# Altium schematic sheet PowerSupplies.SchDoc
size A4
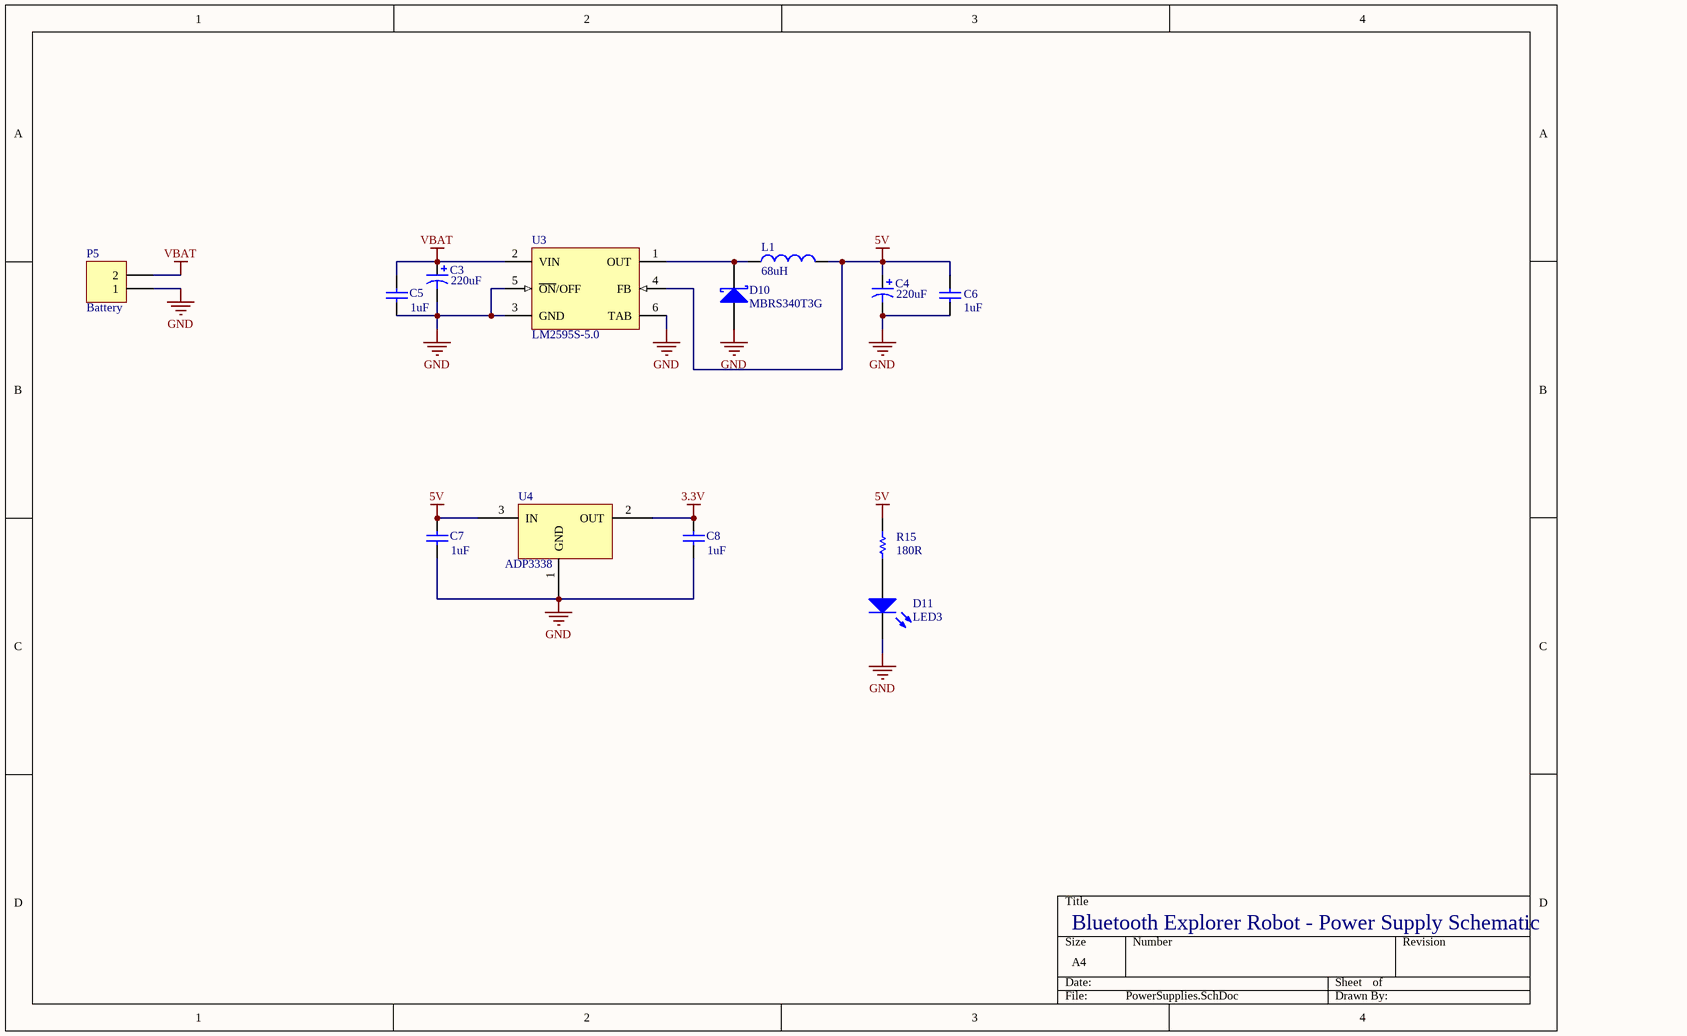
[diagram p0: PowerSupplies.SchDoc]

## Parts
C3  value 220uF  [Cap F]  (hidden comment: Cap Pol1)
C4  value 220uF  [Cap F]  (hidden comment: Cap Pol1)
C5  value 1uF  [C0805]  (hidden comment: Cap Semi)
C6  value 1uF  [C0805]  (hidden comment: Cap Semi)
C7  value 1uF  [C0805]  (hidden comment: Cap Semi)
C8  value 1uF  [C0805]  (hidden comment: Cap Semi)
D10  MBRS340T3G  [SMC]
D11  LED3  [DSO-C2/D5.6]
L1  value 68uH  [inductor_epcos]
P5  Battery  [PCB Screw Connector]
R15  value 180R  [2012[0805]]  (hidden comment: Res Semi)
U3  LM2595S-5.0  [TS5B_N]
U4  ADP3338  [SOT223-4l]

## Nets
3.3V: C8.2 U4.2(OUT)
5V: C4.1 C6.2 C7.2 L1.2 R15.2 U3.4(FB) U4.3(IN)
GND: C3.2 C4.2 C5.1 C6.1 C7.1 C8.1 D10.1(A) D11.2(K) P5.1 U3.3(GND) U3.5(~{ON}/OFF) U3.6(TAB) U4.1(GND)
VBAT: C3.1 C5.2 P5.2 U3.2(VIN)
NetD10_2: D10.2(K) L1.1 U3.1(OUT)
NetD11_1: D11.1(A) R15.1

## Notes on the sheet
- Bluetooth Explorer Robot - Power Supply Schematic

## Library data of the parts
C3 C4 = Cap Pol1: Polarized Capacitor (Radial); Published: 8-Jun-2000; LatestRevisionDate: 17-Jul-2002; LatestRevisionNote: Re-released for DXP Platform.; PackageReference: RB7.6-15; Publisher: Altium Limited
C5-C8 = Cap Semi: Capacitor (Semiconductor SIM Model); Published: 8-Jun-2000; LatestRevisionDate: 29-May-2009; LatestRevisionNote: IPC-7351 Footprint Added.; PackageReference: C1206; Publisher: Altium Limited; PackageDescription: Chip Capacitor
D10 = D Schottky: Schottky Diode; Published: 8-Jun-2000; LatestRevisionDate: 17-Jul-2002; LatestRevisionNote: Re-released for DXP Platform.; PackageReference: SMB; Publisher: Altium Limited; Code_JEDEC: DO-214-AA
D11 = LED3: Typical BLUE SiC LED; Published: 8-Jun-2000; LatestRevisionDate: 17-Dec-2003; LatestRevisionNote: PCB Footprint replaced.; DatasheetVersion: 16-Apr-2002; PackageVersion: 16-Apr-2002; PackageReference: 3.5X2.8X1.9; Publisher: Altium Limited
L1 = Inductor: Code_IEC: 1005; Published: 8-Jun-2000; LatestRevisionDate: 17-Jul-2002; LatestRevisionNote: Re-released for DXP Platform.; PackageReference: 0402-A; Publisher: Altium Limited; Code_JEITA: 0402
P5 = Header 2: Header, 2-Pin; LatestRevisionDate: 17-Jul-2002; LatestRevisionNote: Re-released for DXP Platform.; Publisher: Altium Limited
R15 = Res Semi: Semiconductor Resistor; Published: 8-Jun-2000; LatestRevisionDate: 17-Jul-2002; LatestRevisionNote: Re-released for DXP Platform.; PackageReference: AXIAL-0.5; Publisher: Altium Limited
U3 = LM2595S-5.0: SIMPLE SWITCHER Power Converter 150 KHz 1A Step-Down Voltage Regulator; Manufacturer: National Semiconductor; PackageTopMarking: NSUZXYTT*LM2595S*-5.0 P+; PowerWise: N; FirstPublished: 4-Dec-2008; DatasheetVersion: May-1999; PackageVersion: revD, Apr-2005; PackageReference: TS5B; Publisher: Altium Limited; PackageDescription: TO-263, Molded, .400 x .390 x .180in, 5 Lead, .067in Pitch, Surface Mount; CompType: Switcher; PartNumber: LM2595S-5.0; RoHS: O; PinCount: 5; DigiKeyPartNumber: LM2595S-5.0-ND; Code_JEDEC: MO-169-AB; ComponentLink1Description: LM2595 Datasheet; ComponentLink1URL: http://www.national.com/ds/LM/LM2595.pdf; ComponentLink2Description: LM2595 Web Page; ComponentLink2URL: http://www.national.com/pf/LM/LM2595.html; ComponentLink3Description: TS5B Package Page; ComponentLink3URL: http://www.national.com/packaging/folders/ts5b.html